# Altium schematic sheet Power_Supply.SchDoc
size A4
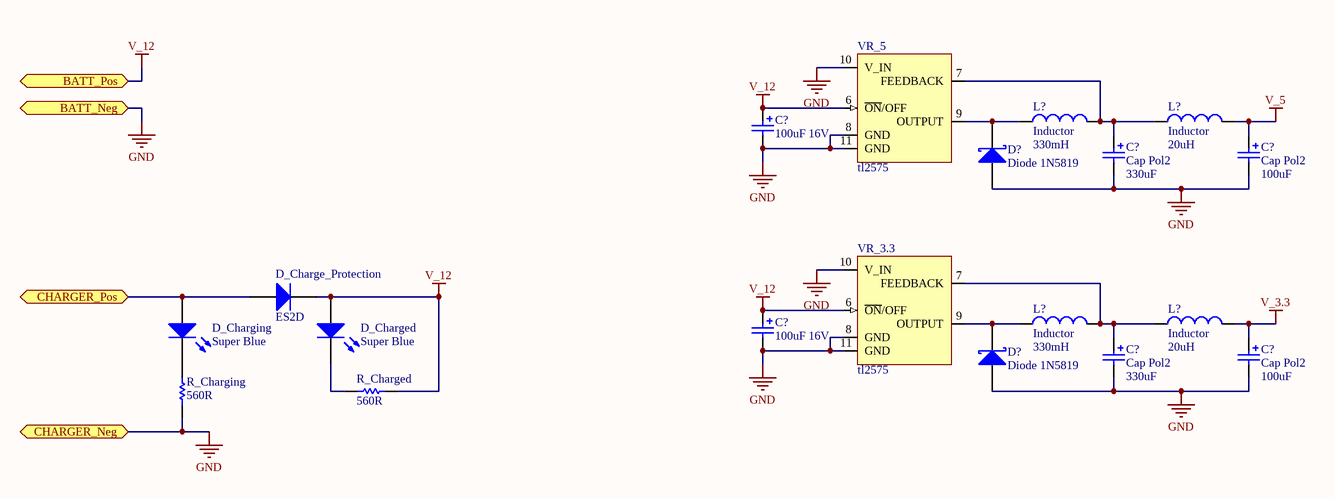
[diagram p0: Power_Supply.SchDoc]

## Parts
(Parts that share a designator on the sheet are numbered #1, #2 ... from top to bottom, then left to right.)
C?#1  100uF 16V  [TANT7343]
C?#2  Cap Pol2  value 330uF  [POLAR0.8]
C?#3  Cap Pol2  value 100uF  [POLAR0.8]
C?#4  100uF 16V  [TANT7343]
C?#5  Cap Pol2  value 330uF  [POLAR0.8]
C?#6  Cap Pol2  value 100uF  [POLAR0.8]
D?#1  Diode 1N5819  [SOT95P240-3N]
D?#2  Diode 1N5819  [SOT95P240-3N]
D_Charge_Protection  ES2D  [DIODE_SMB]
D_Charged  Super Blue  [LED0805]
D_Charging  Super Blue  [LED0805]
L?#1  Inductor  value 330mH  [INDC1005AL]
L?#2  Inductor  value 20uH  [INDC1005AL]
L?#3  Inductor  value 330mH  [INDC1005AL]
L?#4  Inductor  value 20uH  [INDC1005AL]
R_Charged  560R  [R0603]
R_Charging  560R  [R0603]
VR_3.3  tl2575
VR_5  tl2575

## Ports
BATT_Neg, BATT_Pos, CHARGER_Neg, CHARGER_Pos

## Nets
GND: C?#1.2 C?#2.2 C?#3.2 C?#4.2 C?#5.2 C?#6.2 D?#1.1(A) D?#2.1(A) R_Charging.1 VR_3.3.8(GND) VR_3.3.10(V_IN) VR_3.3.11(GND) VR_5.8(GND) VR_5.10(V_IN) VR_5.11(GND) ; port CHARGER_Neg, port BATT_Neg
V_3.3: C?#6.1 L?#4.2
V_5: C?#3.1 L?#2.2
V_12: C?#1.1 C?#4.1 D_Charge_Protection.2(K) D_Charged.1(A) R_Charged.1 VR_3.3.6(~{ON}/OFF) VR_5.6(~{ON}/OFF) ; port BATT_Pos
CHARGER_Pos: D_Charge_Protection.1(A) D_Charging.1(A) ; port CHARGER_Pos
NetC?#2_1: C?#2.1 L?#1.2 L?#2.1 VR_5.7(FEEDBACK)
NetC?#5_1: C?#5.1 L?#3.2 L?#4.1 VR_3.3.7(FEEDBACK)
NetD?#1_3: D?#1.3(K) L?#1.1 VR_5.9(OUTPUT)
NetD?#2_3: D?#2.3(K) L?#3.1 VR_3.3.9(OUTPUT)
NetD_Charged_2: D_Charged.2(K) R_Charged.2
NetD_Charging_2: D_Charging.2(K) R_Charging.2

## Library data of the parts
C?#1 C?#4 = TANT100uF_16V_7343: SM Tantalum Cap; Supplier_Component_Code: RZ-6577; published: 12/03/2007 11:34:36 a.m.; Supplier_Name: Soanar Plus; price: 5.45; value: 100uF 16V; Part Number: TANT100uF_16V_7343; Component Kind: Standard; Component Type: Standard; Designator: TANT100uF_16V_7343; Pin Count: 2
C?#2 C?#3 C?#5 C?#6 = Cap Pol2: Polarized Capacitor (Axial); Published: 8-Jun-2000; LatestRevisionDate: 17-Jul-2002; LatestRevisionNote: Re-released for DXP Platform.; PackageReference: POLAR0.8; Publisher: Altium Limited
D?#1 D?#2 = Diode BAS70: Silicon AF Schottky Diode for High-Speed Switching; Note: Pin 2 is not connected and not drawn.; Published: 21-Mar-2003; LatestRevisionDate: 29-May-2009; LatestRevisionNote: IPC-7351 Footprint Added.; DatasheetVersion: Oct-1999; PackageVersion: Sep-2001; PackageReference: SOT-23; Publisher: Altium Limited; PackageDescription: 3-Pin SOT-23 Package 0.95 mm Pitch, 2.5 mm Lead Span; ComponentLink1Description: Manufacturer Link; ComponentLink1URL: http://www.infineon.com/; ComponentLink2Description: Datasheet; ComponentLink2URL: http://www.infineon.com/upload/Document/cmc_upload/documents/009/382/bas40_bas140series_1.pdf
D_Charge_Protection = ES2D-E3/52T: DIODE ULTRA FAST 2A 200V SMB; ECE_Component_Code: ES2D-E3/52T; value: ES2D; Supplier_Component_Code: ES2D-E3/52TGICT-ND; published: 31/05/2007; Supplier_Name: Digikey; price: 0.26; Part Number: ES2D-E3/52T; Component Kind: Standard; Component Type: Standard; Designator: ES2D-E3/52T; Pin Count: 2
D_Charged D_Charging = LED0805_S_BLUE: LED 0805 Super Blue; component_type: Opto; ECE_Component_Code: LED0805_S_BLUE; Supplier_Component_Code: ZD-P030; published: 12/03/2007 11:34:37 a.m.; Supplier_Name: Soanar Plus; price: 1.91; value: Super Blue; Part Number: LED0805_S_BLUE; Component Kind: Standard; Component Type: Standard; Designator: LED0805_S_BLUE; Pin Count: 2
L?#1-L?#4 = Inductor: Code_IEC: 1005; Published: 8-Jun-2000; LatestRevisionDate: 29-May-2009; LatestRevisionNote: IPC-7351 Footprint Added.; PackageReference: 0402-A; Publisher: Altium Limited; PackageDescription: Chip Inductor; Code_JEITA: 0402
R_Charged R_Charging = 560R_R0603: 0603 Resistor; ECE_Component_Code: 560R_R0603; value: 560R; Supplier_Component_Code: RS-S067; published: 12/03/2007 11:34:34 a.m.; Supplier_Name: Soanar Plus; price: 0.08; Part Number: 560R_R0603; Component Kind: Standard; Component Type: Standard; Designator: 560R_R0603; Pin Count: 2